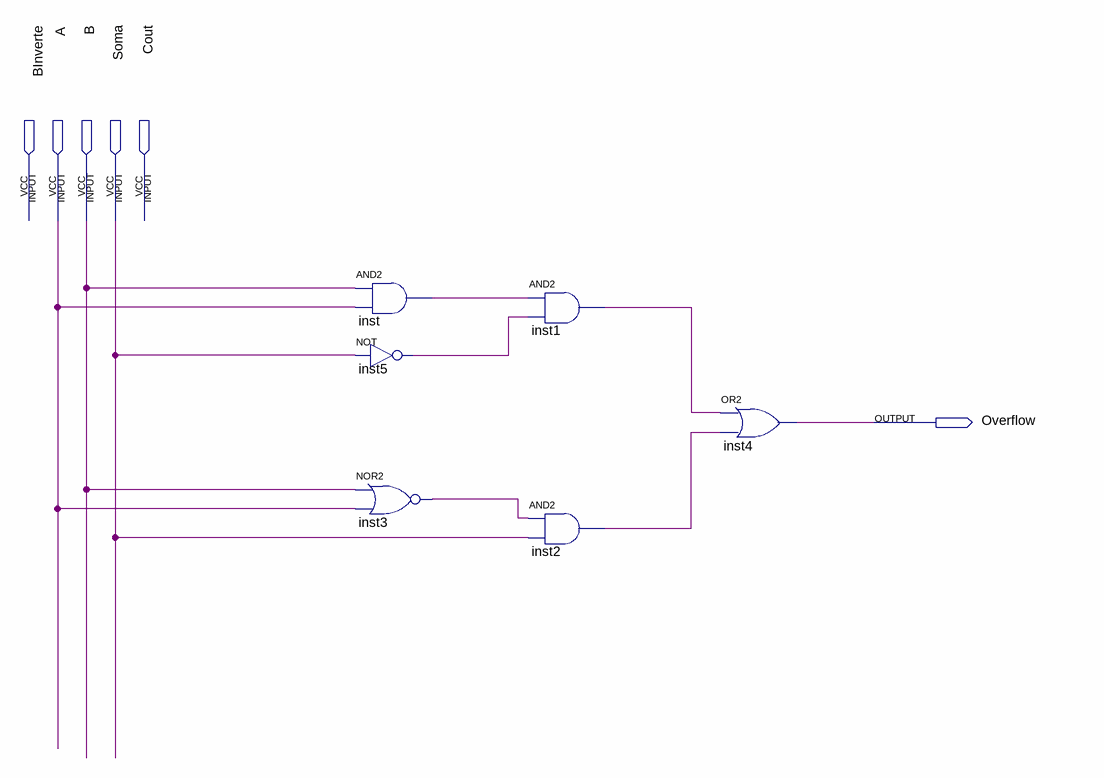
[diagram p0: schematic sheet]
// Quartus schematic DetectorOverflow.bdf as structural Verilog: 6 symbols, 6 pins
module DetectorOverflow (
  input  BInverte,
  input  A,
  input  B,
  input  Soma,
  input  Cout,
  output Overflow
);

  wire inst1_out, inst2_out, inst3_out, inst5_out, inst_out;

  and inst (inst_out, B, A);
  not inst5 (inst5_out, Soma);
  nor inst3 (inst3_out, B, A);
  and inst1 (inst1_out, inst_out, inst5_out);
  and inst2 (inst2_out, inst3_out, Soma);
  or inst4 (Overflow, inst1_out, inst2_out);
endmodule
